# EAGLE board SzineszFeny_V11 (EAGLE 7.5.0), part 1 of 2
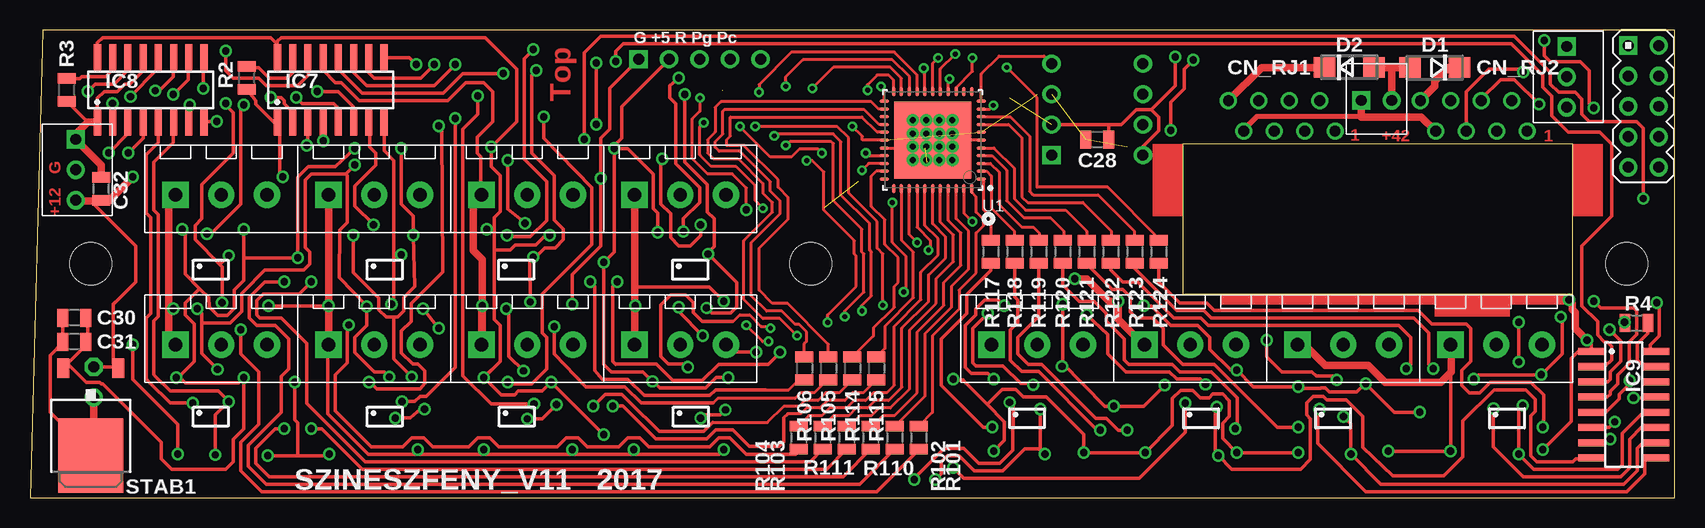
[diagram p2: board, top side]
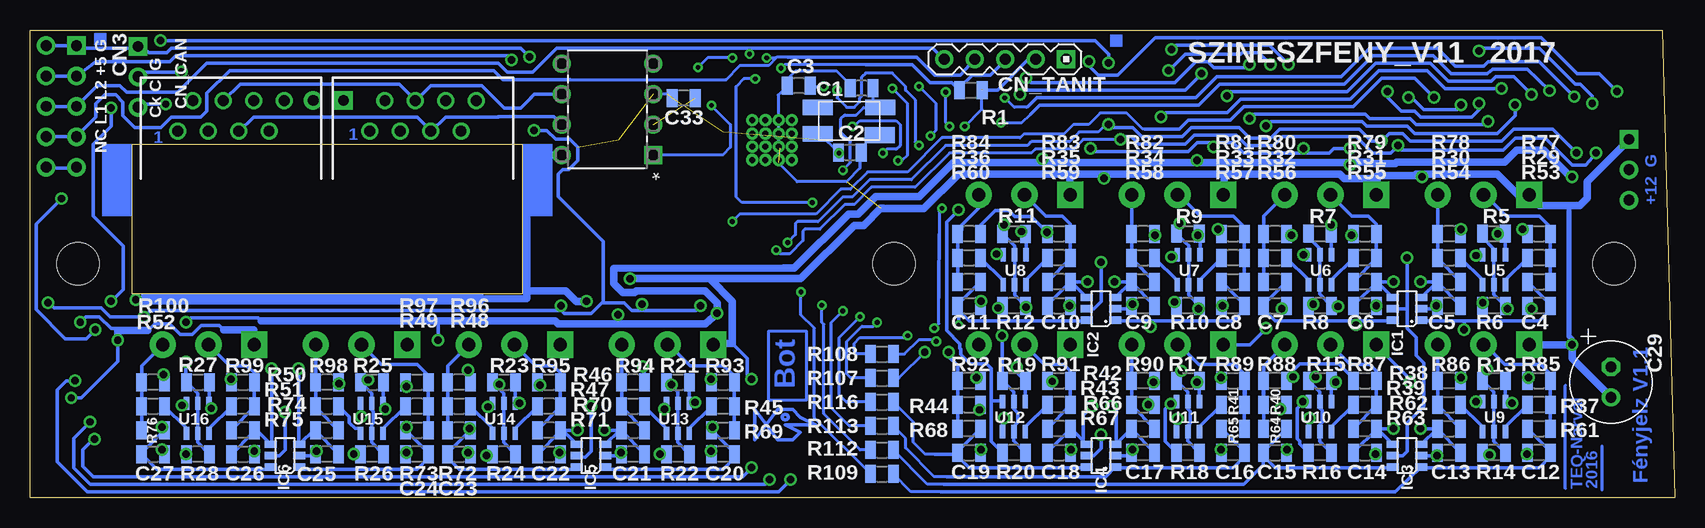
[diagram p3: board, bottom side, seen from below]

Size 137.06 x 39 mm. Coordinates in mm from the lower left corner, seen from the top.
Outline: 0,0 137.06,0 137.06,39 1.06,39 0,0
Outline: 128.56,29.5 96.06,29.5 96.06,17 128.56,17 128.56,29.5
Copper layers (1*16): Top 0.035mm / dielectric 1.5mm / Bottom 0.035mm
Design rules "default": minimum track width 10mil, minimum drill 24mil, track to track 12mil, track to pad 12mil, pad to pad 12mil, via to via 12mil, smd to smd 0mil, copper to edge 12mil, drill to drill 8mil, minimum pad ring 10mil, minimum via ring 8mil, stop-mask expansion 4mil, vias tented up to drill 0mil, thermal gap 10mil
Net classes: 0 default: width 0.305 mm, clearance 0.305 mm; 1 Tap: width 0.406 mm, clearance 0.305 mm
Holes 3.5 mm at 65.06,19.5 5.06,19.5 133.06,19.5
tRestrict: area 61.6,16 to 68.6,23; area 1.6,16 to 8.6,23; area 129.6,16 to 136.6,23
bRestrict: area 61.6,16 to 68.6,23; area 1.6,16 to 8.6,23; area 129.6,16 to 136.6,23

## Footprints (pad centres in the part's own frame; a part is rotated, then mirrored left to right if it is on the bottom)
R0805 = smd 0.9 x 1.5: 1 -0.953,0; 2 0.953,0
C_EL1RASZT07 = drill 0.914 pad 1.524 octagon: P+ 1.27,0 | drill 0.914 pad 1.524: P- -1.27,0
DIP254P762X432-8 = drill 0.914 pad 1.524 square: 1 -3.81,3.81 | drill 0.914 pad 1.524: 2 -3.81,1.27; 3 -3.81,-1.27; 4 -3.81,-3.81; 5 3.81,-3.81; 6 3.81,-1.27; 7 3.81,1.27; 8 3.81,3.81
PIN05_2 = drill 0.914 pad 1.524 square: 1 -5.08,0 | drill 0.914 pad 1.524: 2 -5.08,2.54; 3 -2.54,0; 4 -2.54,2.54; 5 0,0; 6 0,2.54; 7 2.54,0; 8 2.54,2.54; 9 5.08,0; 10 5.08,2.54
RJ45_CSAKPIN = drill 0.9 pad 1.4: 1 -4.445,3.81; 2 -3.175,6.35; 3 -1.905,3.81; 4 -0.635,6.35; 5 0.635,3.81; 6 1.905,6.35; 7 3.175,3.81; 8 4.445,6.35
PIN05_1 = drill 0.914 pad 1.524 square: 1 -5.08,0 | drill 0.914 pad 1.524: 2 -2.54,0; 3 0,0; 4 2.54,0; 5 5.08,0
DO214AC = smd 1.8 x 1.7: A 2.05,0; C -2.05,0
TSOP-6 = smd 0.6 x 1: 1 -0.95,-1.2; 2 0,-1.2; 3 0.95,-1.2; 4 0.95,1.2; 5 0,1.2; 6 -0.95,1.2
SO16 = smd 0.6 x 2.2: 1 -4.445,-2.695; 2 -3.175,-2.695; 3 -1.905,-2.695; 4 -0.635,-2.695; 5 0.635,-2.695; 6 1.905,-2.695; 7 3.175,-2.695; 8 4.445,-2.695; 9 4.445,2.695; 10 3.175,2.695; 11 1.905,2.695; 12 0.635,2.695; 13 -0.635,2.695; 14 -1.905,2.695; 15 -3.175,2.695; 16 -4.445,2.695
XTAL_SIWARD_SX-5032 = smd 2.5 x 1.3: P$1 -2.58,-1.1; P$2 2.62,1.1; P$3 -2.58,1.1; P$4 2.6,-1.2
R0805@1 = smd 0.9 x 1.5: 1 -0.953,0; 2 0.953,0
TO252 = smd 1 x 1.6: 1 -2.28,-4.8; 2 2.28,-4.8 | smd 5.4 x 6.2: 3 0,2.5
MICROCHIP_PIC18F45K80-I-ML_2 = smd 0.8 x 0.3: 1 -4.05,3.25; 2 -4.05,2.6; 3 -4.05,1.95; 4 -4.05,1.3; 5 -4.05,0.65; 6 -4.05,0; 7 -4.05,-0.65; 8 -4.05,-1.3; 9 -4.05,-1.95; 10 -4.05,-2.6; 11 -4.05,-3.25; 23 4.05,-3.25; 24 4.05,-2.6; 25 4.05,-1.95; 26 4.05,-1.3; 27 4.05,-0.65; 28 4.05,0; 29 4.05,0.65; 30 4.05,1.3; 31 4.05,1.95; 32 4.05,2.6; 33 4.05,3.25 | smd 0.3 x 0.8: 12 -3.25,-4.05; 13 -2.6,-4.05; 14 -1.95,-4.05; 15 -1.3,-4.05; 16 -0.65,-4.05; 17 0,-4.05; 18 0.65,-4.05; 19 1.3,-4.05; 20 1.95,-4.05; 21 2.6,-4.05; 22 3.25,-4.05; 34 3.25,4.05; 35 2.6,4.05; 36 1.95,4.05; 37 1.3,4.05; 38 0.65,4.05; 39 0,4.05; 40 -0.65,4.05; 41 -1.3,4.05; 42 -1.95,4.05; 43 -2.6,4.05; 44 -3.25,4.05 | smd 6.43 x 6.43: 45 0,0 | drill 0.5: PAD_8 1.65,-1.65; PAD_9 0.55,-1.65; PAD_10 -0.55,-1.65; PAD_11 -1.65,-1.65; PAD_14 1.65,-0.55; PAD_15 0.55,-0.55; PAD_16 -0.55,-0.55; PAD_17 -1.65,-0.55; PAD_20 1.65,0.55; PAD_21 0.55,0.55; PAD_22 -0.55,0.55; PAD_23 -1.65,0.55; PAD_26 1.65,1.65; PAD_27 0.55,1.65; PAD_28 -0.55,1.65; PAD_29 -1.65,1.65
SOT26 = smd 0.45 x 1.1: P$1 -0.95,-1.25; P$2 0,-1.25; P$3 0.95,-1.25; P$4 0.95,1.25; P$5 0,1.25; P$6 -0.95,1.25
FEHER_TUS_3 = drill 0.914 pad 1.524 square: P$1 0,0 | drill 0.914 pad 1.524: P$2 2.54,0; P$3 5.08,0
FEHER_TUS_2 = drill 0.914 pad 1.524 square: P$1 0,0 | drill 0.914 pad 1.524: P$2 2.54,0
ZOLD_KICSI_3P = drill 1.1 pad 2.184 square: 1 -3.81,-0.5 | drill 1.1 pad 2.184: 2 0,-0.5; 3 3.81,-0.5

## Placement (x,y rotation side)
C1  22  [R0805]  67.76,34.14 180 bottom
C2  22  [R0805]  68.73,28.79 0 bottom
C3  10u  [R0805]  72.99,34.34 180 bottom
C4  100n  [R0805]  11.31,16 180 bottom
C5  100n  [R0805]  18.81,16 180 bottom
C6  100n  [R0805]  25.81,16 0 bottom
C7  100n  [R0805]  33.31,16 0 bottom
C8  100n  [R0805]  36.81,16 180 bottom
C9  100n  [R0805]  44.31,16 180 bottom
C10  100n  [R0805]  51.31,16 0 bottom
C11  100n  [R0805]  58.81,16 0 bottom
C12  100n  [R0805]  11.31,3.75 180 bottom
C13  100n  [R0805]  18.81,3.75 180 bottom
C14  100n  [R0805]  25.81,3.75 0 bottom
C15  100n  [R0805]  33.31,3.75 0 bottom
C16  100n  [R0805]  36.81,3.75 180 bottom
C17  100n  [R0805]  44.31,3.75 180 bottom
C18  100n  [R0805]  51.31,3.75 0 bottom
C19  100n  [R0805]  58.81,3.75 0 bottom
C20  100n  [R0805]  79.31,3.62 180 bottom
C21  100n  [R0805]  86.81,3.62 180 bottom
C22  100n  [R0805]  93.81,3.62 0 bottom
C23  100n  [R0805]  101.31,3.62 0 bottom
C24  100n  [R0805]  104.81,3.62 180 bottom
C25  100n  [R0805]  112.31,3.62 180 bottom
C26  100n  [R0805]  119.31,3.62 0 bottom
C27  100n  [R0805]  126.81,3.62 0 bottom
C28  100n  [R0805]  88.94,29.88 0 top
C29  100u  [C_EL1RASZT07]  5.31,9.62 90 bottom
C30  10u  [R0805]  3.69,13 180 top
C31  100n  [R0805]  3.69,15 180 top
C32  100n  [R0805]  5.94,25.75 90 top
C33  100n  [R0805]  82.59,33.32 180 bottom
CANIC  MCP2551  [DIP254P762X432-8]  88.94,32.38 180 bottom
CN3  PIN05_2'THT'  [PIN05_2]  133.19,32.62 270 top
CN_RJ1  RJ45_CSAKPIN  [RJ45_CSAKPIN]  104.31,26.75 0 bottom
CN_RJ2  RJ45_CSAKPIN  [RJ45_CSAKPIN]  120.31,26.75 0 bottom
CN_TANIT  PIN05_1  [PIN05_1]  55.8,36.56 180 bottom
D1  SS16  [DO214AC]  117.06,35.88 180 top
D2  SS16  [DO214AC]  109.94,35.88 0 top
IC1  BEM_VEDO  [TSOP-6]  22.31,15.75 90 bottom
IC2  BEM_VEDO  [TSOP-6]  47.81,15.75 90 bottom
IC3  BEM_VEDO  [TSOP-6]  22.31,3.5 90 bottom
IC4  BEM_VEDO  [TSOP-6]  47.81,3.5 90 bottom
IC5  BEM_VEDO  [TSOP-6]  90.31,3.5 90 bottom
IC6  BEM_VEDO  [TSOP-6]  115.81,3.5 90 bottom
IC7  SCT2168SOP16  [SO16]  25.06,34 0 top
IC8  SCT2168SOP16  [SO16]  10.06,34 0 top
IC9  SCT2168SOP16  [SO16]  132.81,7.75 270 top
Q2  [XTAL_SIWARD_SX-5032]  68.85,31.43 0 bottom
R1  2.2k  [R0805@1]  58.66,33.97 0 bottom
R2  470  [R0805@1]  18.06,35 90 top
R3  470  [R0805@1]  3.06,34 90 top
R4  470  [R0805@1]  133.88,14.56 0 top
R5  10k  [R0805@1]  15.07,22.01 0 bottom
R6  10k  [R0805@1]  15.06,16 180 bottom
R7  10k  [R0805@1]  29.57,22.01 0 bottom
R8  10k  [R0805@1]  29.56,16 180 bottom
R9  10k  [R0805@1]  40.57,22.01 0 bottom
R10  10k  [R0805@1]  40.56,16 180 bottom
R11  10k  [R0805@1]  55.06,22 0 bottom
R12  10k  [R0805@1]  55.06,16 180 bottom
R13  10k  [R0805@1]  15.06,9.75 0 bottom
R14  10k  [R0805@1]  15.06,3.75 180 bottom
R15  10k  [R0805@1]  29.56,9.75 0 bottom
R16  10k  [R0805@1]  29.56,3.75 180 bottom
R17  10k  [R0805@1]  40.56,9.75 0 bottom
R18  10k  [R0805@1]  40.56,3.75 180 bottom
R19  10k  [R0805@1]  55.06,9.75 0 bottom
R20  10k  [R0805@1]  55.06,3.75 180 bottom
R21  10k  [R0805@1]  83.06,9.62 0 bottom
R22  10k  [R0805@1]  83.06,3.62 180 bottom
R23  10k  [R0805@1]  97.56,9.62 0 bottom
R24  10k  [R0805@1]  97.56,3.62 180 bottom
R25  10k  [R0805@1]  108.56,9.62 0 bottom
R26  10k  [R0805@1]  108.56,3.62 180 bottom
R27  10k  [R0805@1]  123.06,9.62 0 bottom
R28  10k  [R0805@1]  123.06,3.62 180 bottom
R29  22  [R0805@1]  11.31,20 180 bottom
R30  22  [R0805@1]  18.81,20 0 bottom
R31  22  [R0805@1]  25.81,20 180 bottom
R32  22  [R0805@1]  33.31,20 0 bottom
R33  22  [R0805@1]  36.81,20 180 bottom
R34  22  [R0805@1]  44.31,20 0 bottom
R35  22  [R0805@1]  51.31,20 180 bottom
R36  22  [R0805@1]  58.81,20 0 bottom
R37  22  [R0805@1]  11.31,7.75 180 bottom
R38  22  [R0805@1]  18.81,7.75 0 bottom
R39  22  [R0805@1]  25.81,7.75 180 bottom
R40  22  [R0805@1]  33.31,7.75 0 bottom
R41  22  [R0805@1]  36.81,7.75 180 bottom
R42  22  [R0805@1]  44.31,7.75 0 bottom
R43  22  [R0805@1]  51.31,7.75 180 bottom
R44  22  [R0805@1]  58.81,7.75 0 bottom
R45  22  [R0805@1]  79.31,7.62 180 bottom
R46  22  [R0805@1]  86.81,7.62 0 bottom
R47  22  [R0805@1]  93.81,7.62 180 bottom
R48  22  [R0805@1]  101.31,7.62 0 bottom
R49  22  [R0805@1]  104.81,7.62 180 bottom
R50  22  [R0805@1]  112.31,7.62 0 bottom
R51  22  [R0805@1]  119.31,7.62 180 bottom
R52  22  [R0805@1]  126.81,7.62 0 bottom
R53  10k  [R0805@1]  11.31,18 0 bottom
R54  10k  [R0805@1]  18.81,18 0 bottom
R55  10k  [R0805@1]  25.81,18 180 bottom
R56  10k  [R0805@1]  33.31,18 180 bottom
R57  10k  [R0805@1]  36.81,18 0 bottom
R58  10k  [R0805@1]  44.31,18 0 bottom
R59  10k  [R0805@1]  51.31,18 180 bottom
R60  10k  [R0805@1]  58.81,18 180 bottom
R61  10k  [R0805@1]  11.31,5.75 0 bottom
R62  10k  [R0805@1]  18.81,5.75 0 bottom
R63  10k  [R0805@1]  25.81,5.75 180 bottom
R64  10k  [R0805@1]  33.31,5.75 180 bottom
R65  10k  [R0805@1]  36.81,5.75 0 bottom
R66  10k  [R0805@1]  44.31,5.75 0 bottom
R67  10k  [R0805@1]  51.31,5.75 180 bottom
R68  10k  [R0805@1]  58.81,5.75 180 bottom
R69  10k  [R0805@1]  79.31,5.62 0 bottom
R70  10k  [R0805@1]  86.81,5.62 0 bottom
R71  10k  [R0805@1]  93.81,5.62 180 bottom
R72  10k  [R0805@1]  101.31,5.62 180 bottom
R73  10k  [R0805@1]  104.81,5.62 0 bottom
R74  10k  [R0805@1]  112.31,5.62 0 bottom
R75  10k  [R0805@1]  119.31,5.62 180 bottom
R76  10k  [R0805@1]  126.81,5.62 180 bottom
R77  10k  [R0805@1]  11.31,22 0 bottom
R78  10k  [R0805@1]  18.81,22 180 bottom
R79  10k  [R0805@1]  25.81,22 0 bottom
R80  10k  [R0805@1]  33.31,22 180 bottom
R81  10jk  [R0805@1]  36.81,22 0 bottom
R82  10k  [R0805@1]  44.31,22 180 bottom
R83  10k  [R0805@1]  51.31,22 0 bottom
R84  10k  [R0805@1]  58.81,22 180 bottom
R85  10k  [R0805@1]  11.31,9.75 0 bottom
R86  10k  [R0805@1]  18.81,9.75 180 bottom
R87  10k  [R0805@1]  25.81,9.75 0 bottom
R88  10k  [R0805@1]  33.31,9.75 180 bottom
R89  10k  [R0805@1]  36.81,9.75 0 bottom
R90  10k  [R0805@1]  44.31,9.75 180 bottom
R91  10k  [R0805@1]  51.31,9.75 0 bottom
R92  10k  [R0805@1]  58.81,9.75 180 bottom
R93  10k  [R0805@1]  79.31,9.62 0 bottom
R94  10k  [R0805@1]  86.81,9.62 180 bottom
R95  10k  [R0805@1]  93.81,9.62 0 bottom
R96  10k  [R0805@1]  101.31,9.62 180 bottom
R97  10k  [R0805@1]  104.81,9.62 0 bottom
R98  10k  [R0805@1]  112.31,9.62 180 bottom
R99  10k  [R0805@1]  119.31,9.62 0 bottom
R100  10k  [R0805@1]  126.81,9.62 180 bottom
R101  10k  [R0805@1]  74.06,5 270 top
R102  10k  [R0805@1]  72.06,5 270 top
R103  10k  [R0805@1]  66.06,5 270 top
R104  10k  [R0805@1]  64.06,5 270 top
R105  10k  [R0805@1]  66.54,10.78 270 top
R106  10k  [R0805@1]  64.54,10.78 270 top
R107  10k  [R0805@1]  66.06,9.96 0 bottom
R108  10k  [R0805@1]  66.06,11.96 0 bottom
R109  10k  [R0805@1]  66.06,1.96 0 bottom
R110  10k  [R0805@1]  70.06,5 270 top
R111  10k  [R0805@1]  68.06,5 270 top
R112  10k  [R0805@1]  66.06,3.96 0 bottom
R113  10k  [R0805@1]  66.06,5.96 0 bottom
R114  10k  [R0805@1]  68.54,10.78 270 top
R115  10k  [R0805@1]  70.54,10.78 270 top
R116  10k  [R0805@1]  66.06,7.96 0 bottom
R117  10k  [R0805@1]  80.06,20.5 270 top
R118  10k  [R0805@1]  82.06,20.5 270 top
R119  10k  [R0805@1]  84.06,20.5 270 top
R120  10k  [R0805@1]  86.06,20.5 270 top
R121  10k  [R0805@1]  88.06,20.5 270 top
R122  10k  [R0805@1]  90.06,20.5 270 top
R123  10k  [R0805@1]  92.06,20.5 270 top
R124  10k  [R0805@1]  94.06,20.5 270 top
STAB1  7805DT  [TO252]  5.06,6 180 top
U1  MICROCHIP_PIC18F45K80-I-MLMICROCHIP_PIC18F45K80-I-ML_0_2  [MICROCHIP_PIC18F45K80-I-ML_2]  75.22,29.81 180 top
U5  FDC6306P  [SOT26]  15.07,19 180 bottom
U6  AP2625GY-HF-3SOT26  [SOT26]  29.57,19 180 bottom
U7  AP2625GY-HF-3SOT26  [SOT26]  40.51,19 180 bottom
U8  AP2625GY-HF-3SOT26  [SOT26]  55.01,18.99 180 bottom
U9  AP2625GY-HF-3SOT26  [SOT26]  15.06,6.75 180 bottom
U10  AP2625GY-HF-3SOT26  [SOT26]  29.57,6.75 180 bottom
U11  AP2625GY-HF-3SOT26  [SOT26]  40.57,6.75 180 bottom
U12  AP2625GY-HF-3SOT26  [SOT26]  55.07,6.74 180 bottom
U13  AP2625GY-HF-3SOT26  [SOT26]  83.08,6.61 180 bottom
U14  AP2625GY-HF-3SOT26  [SOT26]  97.58,6.61 180 bottom
U15  AP2625GY-HF-3SOT26  [SOT26]  108.58,6.61 180 bottom
U16  FDC6306P  [SOT26]  123.08,6.61 180 bottom
U$1  FEHER_TUS_3  [FEHER_TUS_3]  128.06,37.62 270 top
U$20  FEHER_TUS_3  [FEHER_TUS_3]  3.81,29.88 270 top
U$21  FEHER_TUS_2ALLO  [FEHER_TUS_2]  110.94,33.12 0 top
ZOLD_3P1  ZOLD_KICSI_3P  [ZOLD_KICSI_3P]  15.94,25.75 0 top
ZOLD_3P2  ZOLD_KICSI_3P  [ZOLD_KICSI_3P]  28.69,25.75 0 top
ZOLD_3P3  ZOLD_KICSI_3P  [ZOLD_KICSI_3P]  41.44,25.75 0 top
ZOLD_3P4  ZOLD_KICSI_3P  [ZOLD_KICSI_3P]  54.19,25.75 0 top
ZOLD_3P5  ZOLD_KICSI_3P  [ZOLD_KICSI_3P]  15.94,13.25 0 top
ZOLD_3P6  ZOLD_KICSI_3P  [ZOLD_KICSI_3P]  28.69,13.25 0 top
ZOLD_3P7  ZOLD_KICSI_3P  [ZOLD_KICSI_3P]  41.44,13.25 0 top
ZOLD_3P8  ZOLD_KICSI_3P  [ZOLD_KICSI_3P]  54.19,13.25 0 top
ZOLD_3P9  ZOLD_KICSI_3P  [ZOLD_KICSI_3P]  83.94,13.25 0 top
ZOLD_3P10  ZOLD_KICSI_3P  [ZOLD_KICSI_3P]  96.69,13.25 0 top
ZOLD_3P11  ZOLD_KICSI_3P  [ZOLD_KICSI_3P]  109.44,13.25 0 top
ZOLD_3P12  ZOLD_KICSI_3P  [ZOLD_KICSI_3P]  122.19,13.25 0 top